# EAGLE design Cricket_Tr (EAGLE 5.06)
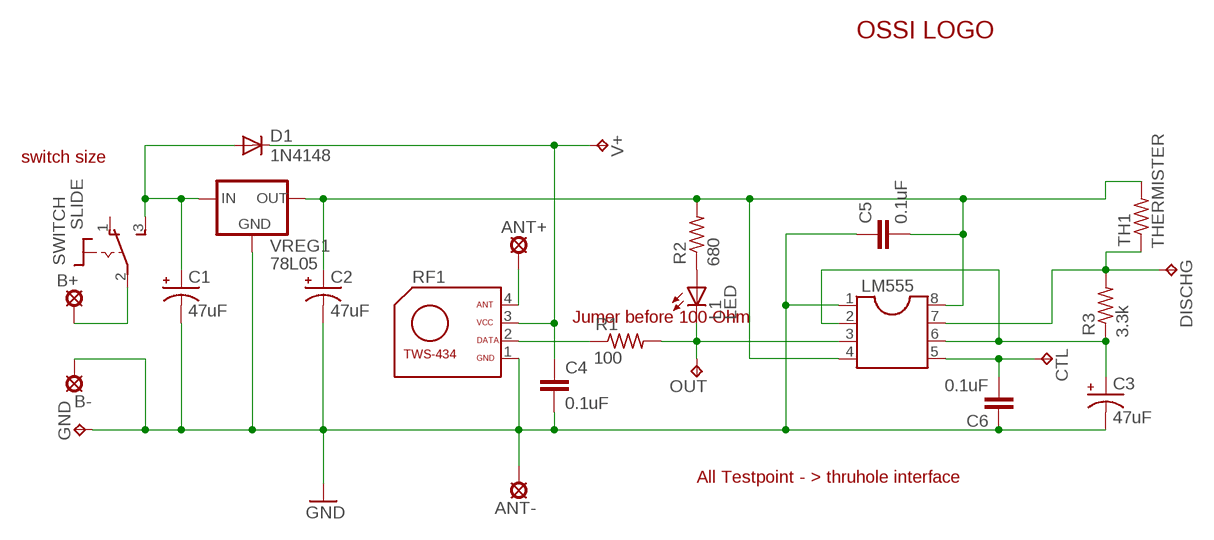
[diagram p0: schematic, sheet 1]

## Parts
ANT+  FIXPAD  [FIXPAD]
ANT-  FIXPAD  [FIXPAD]
B+  FIXPAD  [FIXPAD]
B-  FIXPAD  [FIXPAD]
C1  47uF  CAPACITOR_POL  [CAPACITOR_POL]
C2  47uF  CAPACITOR_POL  [CAPACITOR_POL]
C3  47uF  CAPACITOR_POL  [CAPACITOR_POL]
C4  0.1uF  CAPACITOR  [CAPACITOR]
C5  0.1uF  CAPACITOR  [CAPACITOR]
C6  0.1uF  CAPACITOR  [CAPACITOR]
CTL  TPB1,27  [B1,27]
D1  1N4148  [1N4148]
DISCHG  TPB1,27  [B1,27]
GND  TPB1,27  [B1,27]
L1  LED  [LED]
LM555  DIL8S  [SOCKET-08]
OUT  TPB1,27  [B1,27]
R1  100  RESISTOR  [RESISTOR]
R2  680  RESISTOR  [RESISTOR]
R3  3.3k  RESISTOR  [RESISTOR]
RF1  TWS-434  [TWS-434]
SWITCH  SLIDE  [SLIDE]
TH1  THERMISTER  [THERMISTER]
U$1  OSSILOGO-10  [OSSILOGO1010]
V+  TPB1,27  [B1,27]
VREG1  78L05  [78L05]

## Nets
B+ [power]: C1.+ D1.A SWITCH.3(S) VREG1.I(IN)
CTL: C6.P$2 CTL.PP(TP) LM555.5
EFDSG [power]: C4.P$1 D1.C RF1.3(VCC) V+.PP(TP)
GND [power]: ANT-.P$1(MP) B-.P$1(MP) C1.- C2.- C3.- C4.P$2 C5.P$1 C6.P$1 GND.PP(TP) LM555.1 RF1.1(GND) VREG1.G(GND)
N$1 [power]: ANT+.P$1(MP) RF1.4(ANT)
N$2 [power]: C2.+ C5.P$2 LM555.4 LM555.8 R2.P$2 TH1.P$2 VREG1.O(OUT)
N$3 [power]: B+.P$1(MP) SWITCH.2(P)
N$5: R1.P$1 RF1.2(DATA)
N$6: L1.C LM555.3 OUT.PP(TP) R1.P$2
N$7: L1.A R2.P$1
N$12: DISCHG.PP(TP) LM555.7 R3.P$2 TH1.P$1
VC1: C3.+ LM555.2 LM555.6 R3.P$1
Unconnected: SWITCH.1(O)

## Notes on the sheet
- switch size
- Jumer before 100 Ohm
- All Testpoint - > thruhole interface

## Library data of the parts
ANT+ ANT- B+ B- = lbr\Hole:FIXPAD
C1-C3 = RCcomponent:CAPACITOR_POL: Capacitor $ Kit
C4-C6 = RCcomponent:CAPACITOR: Capacitor $ Kit
CTL DISCHG GND OUT V+ = testpad:TP: Test pad
D1 = Power:1N4148: Diode $ Kit
L1 = Power:LED: LED $ Kit
LM555 = ic-package:DIL8: Dual In Line / Socket
R1-R3 = RCcomponent:RESISTOR: Resistor $ Kit
RF1 = rfModule:TWS-434: RF Module
SWITCH = Switch:SLIDE
TH1 = RCcomponent:THERMISTER: Thermister $ Kit
U$1 = OSSI:OSSILOGO
VREG1 = lbr\Power:78L05: Voltage Regulator $ Kit

## Net classes
1 power: width 0.762 mm, clearance 0.127 mm

## Board
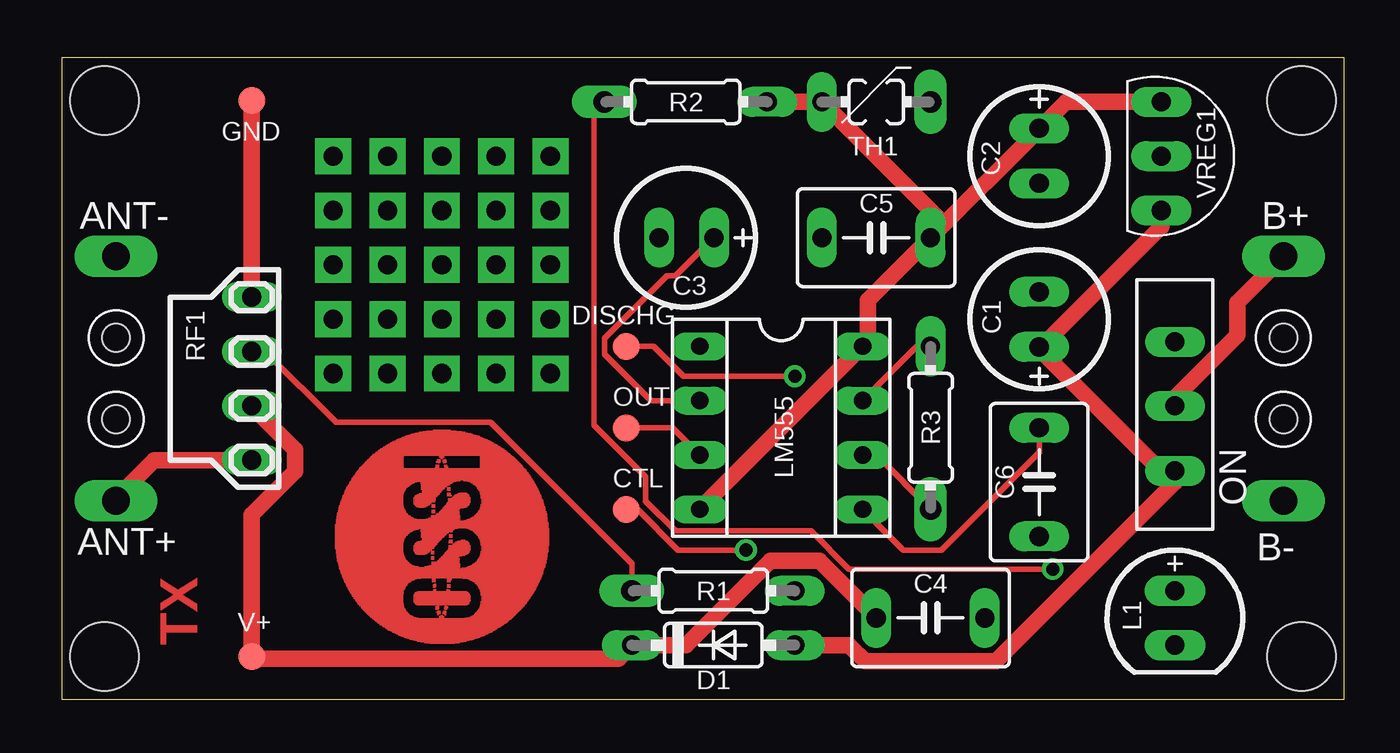
[diagram p1: board, top side]
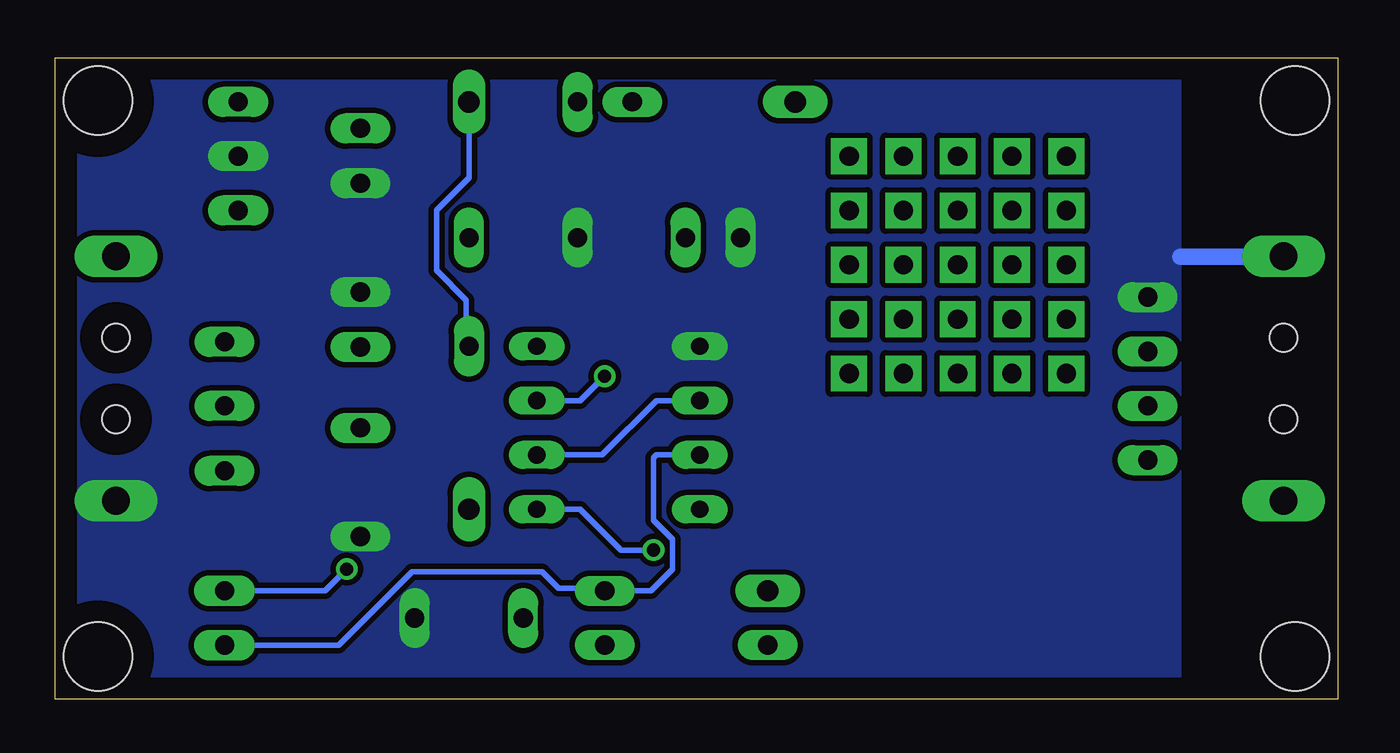
[diagram p2: board, bottom side, seen from below]

Size 60 x 30 mm. Coordinates in mm from the lower left corner, seen from the top.
Outline: 0,0 60,0 60,30 0,30 0,0
Copper layers (1*16): Top 0.035mm / dielectric 1.5mm / Bottom 0.035mm
Design rules "default": minimum track width 10mil, minimum drill 24mil, track to track 8mil, track to pad 8mil, pad to pad 8mil, via to via 8mil, smd to smd 8mil, copper to edge 40mil, drill to drill 8mil, minimum pad ring 10mil, minimum via ring 8mil, stop-mask expansion 4mil, vias tented up to drill 0mil, thermal gap 10mil
Holes 3.2 mm at 2,2 2,28 58,28 58,2

### Footprints (pad centres in the part's own frame; a part is rotated, then mirrored left to right if it is on the bottom)
FIXPAD = drill 1.3 long: P$1 0,0 | hole 1.3: 0,-3.81
CAPACITOR_POL = drill 0.9 pad 1.27 long: + -1.302,0; - 1.27,0
CAPACITOR = drill 0.9 pad 1.27 long: P$1 -2.54,0; P$2 2.54,0
B1,27 = smd 1.27 x 1.27: PP 0,0
1N4148 = drill 0.9 pad 1.27 long: A 3.81,0; C -3.81,0
LED = drill 0.9 pad 1.422 long: A -1.27,0; C 1.27,0
SOCKET-08 = drill 0.813 long: 1 -3.81,-3.81; 2 -1.27,-3.81; 3 1.27,-3.81; 4 3.81,-3.81; 5 3.81,3.81; 6 1.27,3.81; 7 -1.27,3.81; 8 -3.81,3.81
RESISTOR = drill 1 pad 1.27 long: P$1 -3.81,0 | drill 0.9 pad 1.27 long: P$2 3.81,0
TWS-434 = drill 0.9 pad 1.27 long: 1 0,-3.81; 2 0,-1.27; 3 0,1.27; 4 0,3.81
SLIDE = drill 0.9 pad 1.27 long: 1 -2.99,0; 2 0,0; 3 3.04,0
THERMISTER = drill 1 pad 1.27 long: P$1 -2.54,0 | drill 0.9 pad 1.27 long: P$2 2.54,0
78L05 = drill 0.9 pad 1.27 long: G 0,0; I 2.54,0; O -2.54,0

### Placement (x,y rotation side)
ANT+  2.54,9.29 180 top
ANT-  2.54,20.71 0 top
B+  57.15,20.71 0 top
B-  57.15,9.29 180 top
C1  45.72,17.78 90 top
C2  45.72,25.4 270 top
C3  29.21,21.59 180 top
C4  40.64,3.81 0 top
C5  38.1,21.59 0 top
C6  45.72,10.16 90 top
CTL  26.4,8.89 0 top
D1  30.48,2.54 0 top
DISCHG  26.4,16.51 0 top
GND  8.89,28 0 top
L1  52.07,3.81 270 top
LM555  33.66,12.7 270 top
OUT  26.4,12.7 0 top
R1  30.48,5.08 0 top
R2  29.19,27.94 0 top
R3  40.64,12.7 90 top
RF1  8.89,15 180 top
SWITCH  52.07,13.73 270 top
TH1  38.1,27.94 180 top
U$1  17.78,7.62 90 top
V+  8.89,2 0 top
VREG1  51.44,25.4 270 top

### Tracks (layer width: path | path; a pad name or v marks a point on that pad's centre or on a via)
B+
  Top 0.762: D1.A 36.83,2.54 37.59,1.78 43.69,1.78 52.07,10.16 SWITCH.3 51.82,10.29 45.72,16.38 C1.+ 45.97,16.64 51.44,22.1 VREG1.I
CTL  (via drill 0.61)
  Top 0.254: v32,6.99 28.83,6.99 26.92,8.89 CTL.PP | C6.P$2 45.72,11.56 41.15,6.99 39.37,6.99 LM555.5
  Bottom 0.254: v32,6.99 33.53,6.99 35.43,8.89 LM555.5
EFDSG
  Top 0.762: RF1.3 8.89,13.72 10.92,11.68 10.92,10.67 8.89,8.64 V+.PP 9.14,1.91 26.04,1.91 D1.C 29.21,2.54 33.15,6.48 35.43,6.48 C4.P$1
GND
  Top 0.762: RF1.1 GND.PP
  Bottom 0.762: 7.37,20.7 ANT-.P$1
  pour Bottom (isolate 0.254, no thermals): 7.35,30.48 60.46,30.48 60.46,-0.52 7.35,-0.52
N$1
  Top 0.762: RF1.4 8.89,11.18 4.32,11.18 2.54,9.4 ANT+.P$1
N$2
  Top 0.762: LM555.4 LM555.8 37.72,16.76 37.72,18.67 C5.P$2 | R2.P$2 TH1.P$2 41.02,22.48 C5.P$2 | C5.P$2 45.72,26.67 C2.+ 45.97,26.92 46.99,27.94 VREG1.O
N$3
  Top 0.762: SWITCH.2 52.07,14.1 54.99,17.02 54.99,18.54 B+.P$1
N$5
  Top 0.254: R1.P$1 26.67,6.35 20.07,12.95 12.83,12.95 9.53,16.26 8.89,16.26 RF1.2
N$6
  Top 0.254: LM555.3 28.57,12.7 OUT.PP
  Bottom 0.254: LM555.3 31.88,11.43 32,11.3 32,8.38 31.11,7.49 31.11,6.1 32.13,5.08 R1.P$2 34.42,5.21 36.45,5.21 37.21,5.97 43.31,5.97 46.74,2.54 L1.C
N$7  (via drill 0.61)
  Top 0.254: v46.35,6.1 36.83,6.1 35.05,7.87 28.7,7.87 27.3,9.27 27.3,10.41 24.89,12.83 24.89,27.56 25.27,27.94 R2.P$1
  Bottom 0.254: L1.A 47.37,5.08 v46.35,6.1
N$8  (via drill 0.9 pad 1.68)
  other vias: 12.7,25.4
N$9  (via drill 0.9 pad 1.68)
  other vias: 12.7,22.86
N$10  (via drill 0.9 pad 1.68)
  other vias: 12.7,20.32
N$11  (via drill 0.9 pad 1.68)
  other vias: 20.32,15.24
N$12  (via drill 0.61)
  Top 0.254: v34.29,15.11 29.08,15.11 27.69,16.51 DISCHG.PP | R3.P$2 40.01,16.51 LM555.7
  Bottom 0.254: v34.29,15.11 35.43,13.97 LM555.7 | TH1.P$1 40.64,24.38 42.16,22.86 42.16,20.07 40.77,18.67 40.77,16.64 R3.P$2
N$15  (via drill 0.9 pad 1.68)
  other vias: 15.24,20.32
N$16  (via drill 0.9 pad 1.68)
  other vias: 12.7,17.78
N$17  (via drill 0.9 pad 1.68)
  other vias: 12.7,15.24
N$20  (via drill 0.9 pad 1.68)
  other vias: 15.24,15.24
N$21  (via drill 0.9 pad 1.68)
  other vias: 15.24,17.78
N$27  (via drill 0.9 pad 1.68)
  other vias: 15.24,22.86
N$28  (via drill 0.9 pad 1.68)
  other vias: 15.24,25.4
N$31  (via drill 0.9 pad 1.68)
  other vias: 17.78,25.4
N$32  (via drill 0.9 pad 1.68)
  other vias: 17.78,22.86
N$38  (via drill 0.9 pad 1.68)
  other vias: 17.78,17.78
N$39  (via drill 0.9 pad 1.68)
  other vias: 22.86,15.24
N$42  (via drill 0.9 pad 1.68)
  other vias: 17.78,15.24
N$43  (via drill 0.9 pad 1.68)
  other vias: 20.32,17.78
N$49  (via drill 0.9 pad 1.68)
  other vias: 20.32,22.86
N$50  (via drill 0.9 pad 1.68)
  other vias: 20.32,25.4
N$53  (via drill 0.9 pad 1.68)
  other vias: 22.86,25.4
N$54  (via drill 0.9 pad 1.68)
  other vias: 22.86,22.86
N$55  (via drill 0.9 pad 1.68)
  other vias: 22.86,20.32
N$59  (via drill 0.9 pad 1.68)
  other vias: 17.78,20.32
N$60  (via drill 0.9 pad 1.68)
  other vias: 20.32,20.32
N$61  (via drill 0.9 pad 1.68)
  other vias: 22.86,17.78
VC1
  Top 0.254: LM555.6 38.1,11.43 R3.P$1 | LM555.2 27.56,13.97 25.4,16.13 25.4,16.89 28.32,19.81 28.7,19.81 30.48,21.59 C3.+
  Bottom 0.254: LM555.6 34.42,11.43 31.88,13.97 LM555.2

### Text on the board
Top: TX
tPlace: ON | Bigger TX letter | Dimmesion Bigger
tStop: TX